# EAGLE schematic High-Level PCB v3.0 - SAVE 6 footprints (EAGLE 8.7.0)
TITLE: High-Level PCB
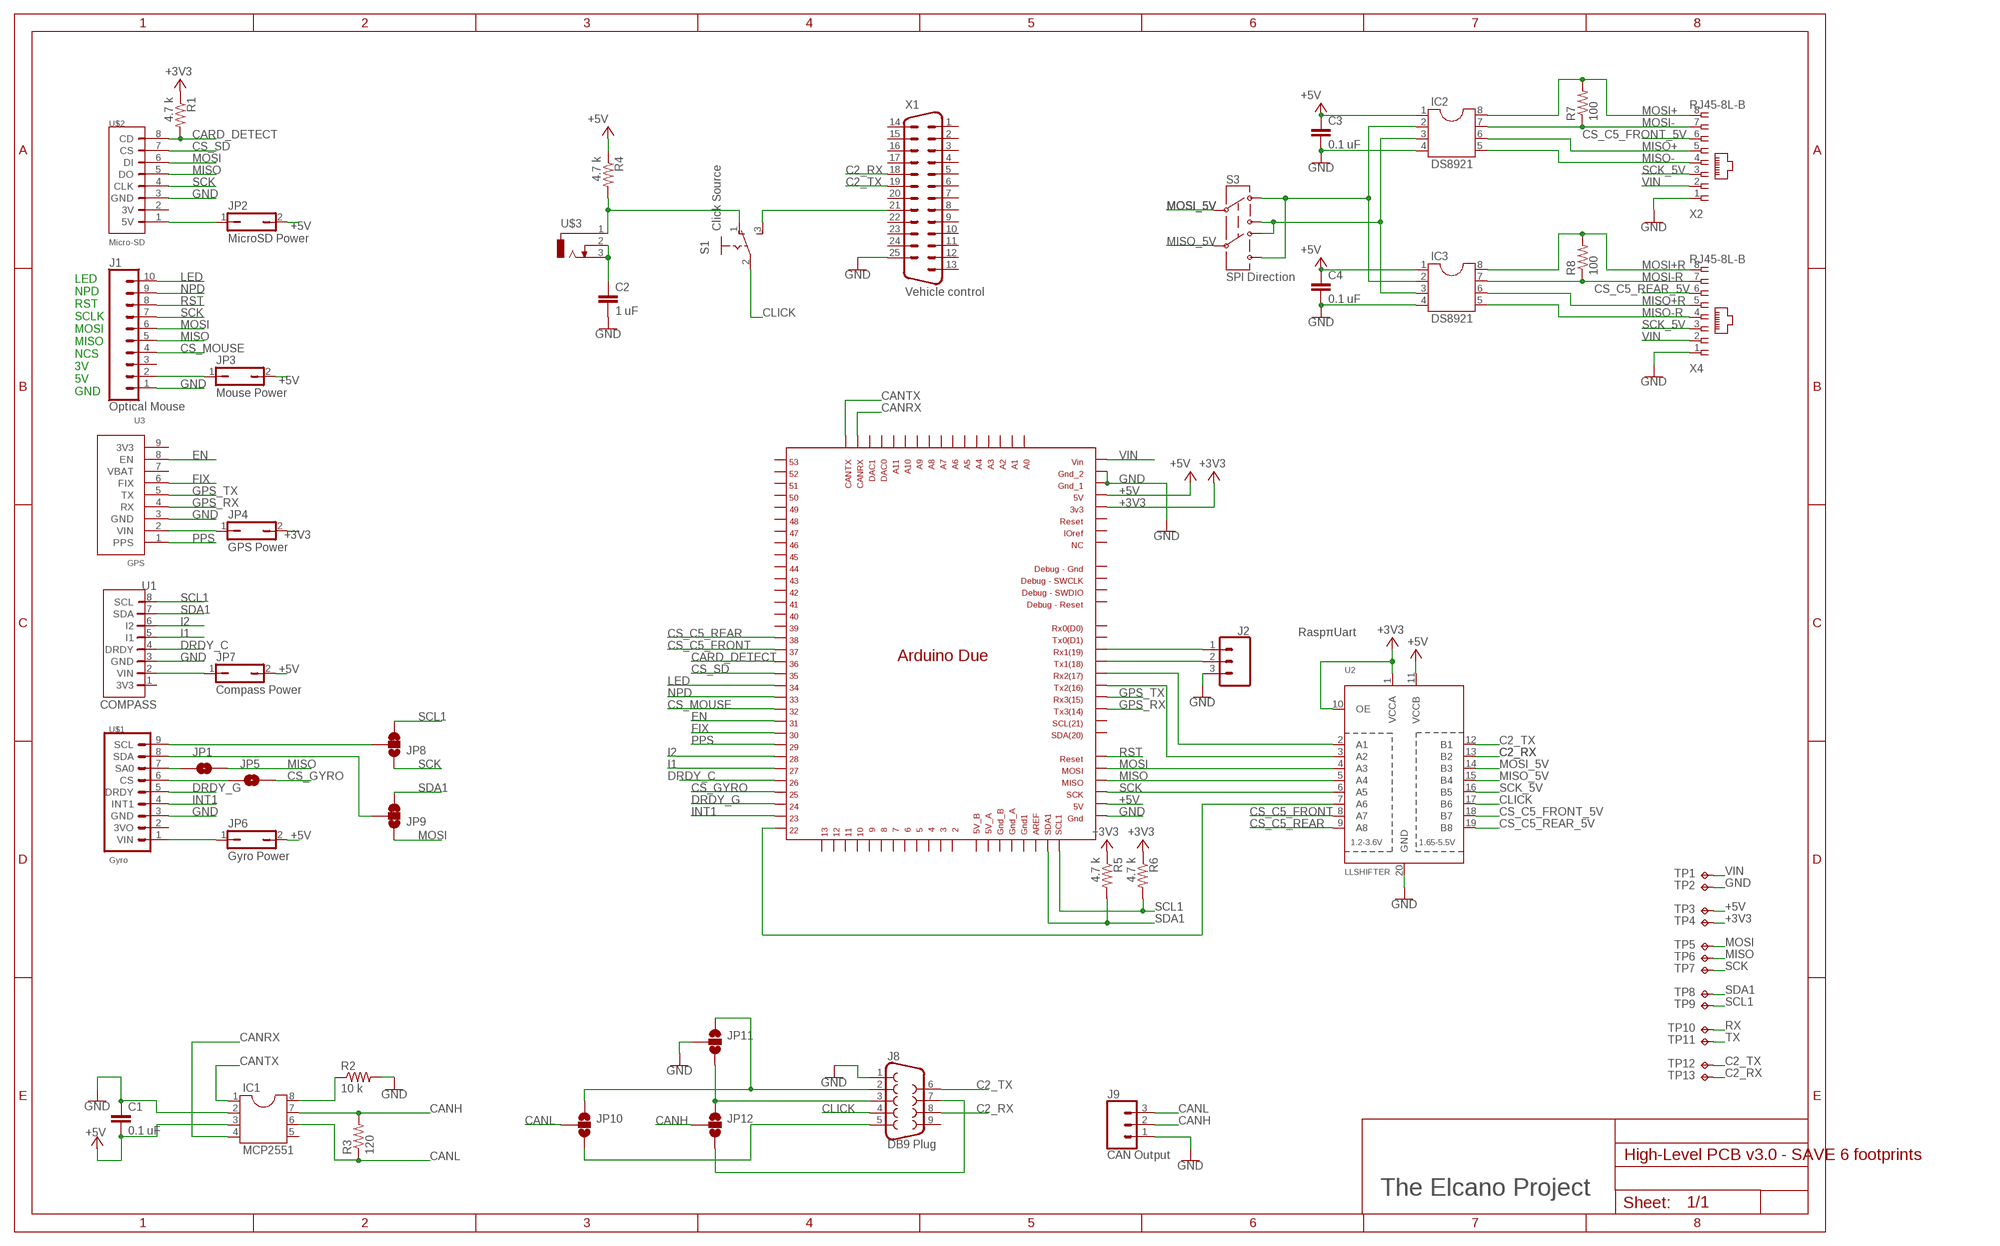
[diagram p0: schematic, sheet 1]

## Parts
C1  0.1 uF  C2.5/5  [C2.5-5]
C2  1 uF  C2.5/5  [C2.5-5]
C3  0.1 uF  C2.5/5  [C2.5-5]
C4  0.1 uF  C2.5/5  [C2.5-5]
IC1  MCP2551  DIL8  [DIL08]
IC2  DS8921  DIL8  [DIL08]
IC3  DS8921  DIL8  [DIL08]
J1  Optical Mouse  CONN_10"  [1X10]
J2  RaspπUart  CONN_02  [1X03]
J8  DB9 Plug  DB9MALE  [DB9_MALE]
J9  CAN Output  CONN_03-SCREW-5MM  [SCREWTERMINAL-5MM-3]
JP1  JUMPER-SMT_2_NO_SILK  [SMT-JUMPER_2_NO_SILK]
JP2  MicroSD Power  JP1Q  [JP1]
JP3  Mouse Power  JP1Q  [JP1]
JP4  GPS Power  JP1Q  [JP1]
JP5  JUMPER-SMT_2_NO_SILK  [SMT-JUMPER_2_NO_SILK]
JP6  Gyro Power  JP1Q  [JP1]
JP7  Compass Power  JP1Q  [JP1]
JP8  JUMPER-SMT_3_1-NC_TRACE_SILK  [SMT-JUMPER_3_1-NC_TRACE_SILK]
JP9  JUMPER-SMT_3_1-NC_TRACE_SILK  [SMT-JUMPER_3_1-NC_TRACE_SILK]
JP10  JUMPER-SMT_3_NO_SILK  [SMT-JUMPER_3_NO_SILK]
JP11  JUMPER-SMT_3_NO_SILK  [SMT-JUMPER_3_NO_SILK]
JP12  JUMPER-SMT_3_NO_SILK  [SMT-JUMPER_3_NO_SILK]
MCU2  DUE(NORMAL)  [DUE(NORMAL)]
R1  4.7 k  R-US_0204/7  [0204/7]
R2  10 k  R-US_0204/7  [0204/7]
R3  120  R-US_0204/7  [0204/7]
R4  4.7 k  R-US_0204/7  [0204/7]
R5  4.7 k  R-US_0204/7  [0204/7]
R6  4.7 k  R-US_0204/7  [0204/7]
R7  100  R-US_0204/7  [0204/7]
R8  100  R-US_0204/7  [0204/7]
S1  Click Source  255SB  [255SB]
S3  SPI Direction  DPDT  [DPDT]
TP1  TPPAD1-17  [P1-17]
TP2  TPPAD1-17  [P1-17]
TP3  TPPAD1-17  [P1-17]
TP4  TPPAD1-17  [P1-17]
TP5  TPPAD1-17  [P1-17]
TP6  TPPAD1-17  [P1-17]
TP7  TPPAD1-17  [P1-17]
TP8  TPPAD1-17  [P1-17]
TP9  TPPAD1-17  [P1-17]
TP10  TPPAD1-17  [P1-17]
TP11  TPPAD1-17  [P1-17]
TP12  TPPAD1-17  [P1-17]
TP13  TPPAD1-17  [P1-17]
U1  COMPASS  ELCOMPASS  [ELCOMPASS]
U2  LLSHIFTER  ELSHIFTER  [ELSHIFTER]
U3  GPS  ELGPS  [ELGPS]
U$1  Gyro  ELGYRO_L3GD20H  [ELGYRO]
U$2  Micro-SD  MINI_SD  [ELSDCARD]
U$3  2.5MMJACK  [2.5MMJACK]
X1  Vehicle control  M25H  [M25H]
X2  RJ45-8L-B  [RJ45-NO-SHIELD]
X4  RJ45-8L-B  [RJ45-NO-SHIELD]

## Nets
+3V3: JP4.2 MCU2.3V3 R1.1 R5.1 R6.1 TP4.TP U2.1(VCCA) U2.10(OE)
+5V: C1.2 C3.1 C4.1 IC1.3 IC2.1 IC3.1 JP2.2 JP3.2 JP6.2 JP7.2 MCU2.5V MCU2.GND_ICSP R4.1 TP3.TP U2.11(VCCB)
C2_RX: J8.8 TP13.TP U2.13(B2) X1.18
C2_TX: J8.6 TP12.TP U2.12(B1) X1.19
CANH: IC1.7 J9.2 JP12.2 R3.2
CANL: IC1.6 J9.3 JP10.2 R3.1
CANRX: IC1.4 MCU2.CANRX
CANTX: IC1.1 MCU2.CANTX
CARD_DETECT: MCU2.36 R1.2 U$2.8(CD)
CLICK: J8.4 S1.2(P) U2.17(B6)
CS_C5_FRONT: MCU2.37 U2.8(A7)
CS_C5_FRONT_5V: U2.18(B7) X2.6
CS_C5_REAR: MCU2.38 U2.9(A8)
CS_C5_REAR_5V: U2.19(B8) X4.6
CS_GYRO: JP5.2 MCU2.25
CS_MOUSE: J1.4 MCU2.32
CS_SD: MCU2.35 U$2.7(CS)
DRDY_C: MCU2.26 U1.4(DRDY)
DRDY_G: MCU2.24 U$1.5(DRDY)
EN: MCU2.31 U3.8(EN)
FIX: MCU2.30 U3.6(FIX)
GND: C1.1 C2.2 C3.2 C4.2 IC1.2 IC2.4 IC3.4 J1.1 J2.3 J8.1 J9.1 JP11.2 MCU2.5V_ICSP MCU2.GND_1 MCU2.GND_2 R2.2 TP2.TP U1.3(GND) U2.20(GND) U3.3(GND) U$1.3(GND) U$2.3(GND) X1.25 X2.1 X4.1
GPS_RX: MCU2.TX3 U3.4(RX)
GPS_TX: MCU2.RX3 U3.5(TX)
I1: MCU2.27 U1.5(I1)
I2: MCU2.28 U1.6(I2)
INT1: MCU2.23 U$1.4(INT1)
LED: J1.10 MCU2.34
MISO: J1.5 JP1.2 MCU2.MISO_ICSP TP6.TP U2.5(A4) U$2.5(DO)
MISO+: IC2.6 X2.5
MISO+R: IC3.6 X4.5
MISO-: IC2.5 X2.4
MISO-R: IC3.5 X4.4
MISO_5V: S3.5 U2.15(B4)
MOSI: J1.6 JP9.1 MCU2.MOSI_ICSP TP5.TP U2.4(A3) U$2.6(DI)
MOSI+: IC2.8 R7.2 X2.8
MOSI+R: IC3.8 R8.2 X4.8
MOSI-: IC2.7 R7.1 X2.7
MOSI-R: IC3.7 R8.1 X4.7
MOSI_5V: S3.2 U2.14(B3)
N$1: C2.1 U$3.2 U$3.3
N$2: IC2.2 IC3.2 S3.1 S3.6
N$3: IC2.3 IC3.3 S3.3 S3.4
N$4: MCU2.TX2 U2.3(A2)
N$5: MCU2.RX2 U2.2(A1)
N$6: S1.3(S) X1.21
N$7: R4.2 S1.1(O) U$3.1
N$8: JP7.1 U1.2(VIN)
N$9: JP6.1 U$1.1(VIN)
N$10: JP2.1 U$2.1(5V)
N$11: J8.3 JP11.3 JP12.1
N$12: MCU2.22 U2.7(A6)
N$13: J1.2 JP3.1
N$14: JP4.1 U3.2(VIN)
N$15: J8.5 JP10.3
N$16: J8.7 JP12.3
N$17: IC1.8 R2.1
N$18: J8.2 JP10.1 JP11.1
N$19: JP5.1 U$1.6(CS)
N$20: JP1.1 U$1.7(SA0)
N$21: JP9.2 U$1.8(SDA)
N$22: JP8.2 U$1.9(SCL)
N$23: J2.1 MCU2.RX1
N$24: J2.2 MCU2.TX1
NPD: J1.9 MCU2.33
PPS: MCU2.29 U3.1(PPS)
RST: J1.8 MCU2.RESET_ICSP
RX: TP10.TP
SCK: J1.7 JP8.1 MCU2.SCK_ICSP TP7.TP U2.6(A5) U$2.4(CLK)
SCK_5V: U2.16(B5) X2.3 X4.3
SCL1: JP8.3 MCU2.SCL1 R6.2 TP9.TP U1.8(SCL)
SDA1: JP9.3 MCU2.SDA1 R5.2 TP8.TP U1.7(SDA)
TX: TP11.TP
VIN: MCU2.VIN TP1.TP X2.2 X4.2
Unconnected: IC1.5 J1.3 J8.9 MCU2.2 MCU2.3 MCU2.4 MCU2.5 MCU2.5V_A MCU2.5V_B MCU2.6 MCU2.7 MCU2.8 MCU2.9 MCU2.10 MCU2.11 MCU2.12 MCU2.13 MCU2.39 MCU2.40 MCU2.41 MCU2.42 MCU2.43 MCU2.44 MCU2.45 MCU2.46 MCU2.47 MCU2.48 MCU2.49 MCU2.50 MCU2.51 MCU2.52 MCU2.53 MCU2.A0 MCU2.A1 MCU2.A2 MCU2.A3 MCU2.A4 MCU2.A5 MCU2.A6 MCU2.A7 MCU2.A8 MCU2.A9 MCU2.A10 MCU2.A11 MCU2.AREF MCU2.DAC0 MCU2.DAC1 MCU2.GND1 MCU2.GND_A MCU2.GND_B MCU2.GND_DEBUG MCU2.IOREF MCU2.NC MCU2.RESET MCU2.RESET_DEBUG MCU2.RX0 MCU2.SCL MCU2.SDA MCU2.SWCLK_DEBUG MCU2.SWDIO_DEBUG MCU2.TX0 U1.1(3V3) U3.7(VBAT) U3.9(3V3) U$1.2(3VO) U$2.2(3V) X1.1 X1.2 X1.3 X1.4 X1.5 X1.6 X1.7 X1.8 X1.9 X1.10 X1.11 X1.12 X1.13 X1.14 X1.15 X1.16 X1.17 X1.20 X1.22 X1.23 X1.24

## Notes on the sheet
- LED
  NPD
  RST
  SCLK
  MOSI
  MISO
  NCS
  3V
  5V
  GND
- The Elcano Project

## Library data of the parts
C1-C4 = capacitor-wima:C: CAPACITOR naming: grid - package width
IC1-IC3 = ic-package:DIL8: Dual In Line / Socket
J1 = SparkFun-Connectors:CONN_10: Multi connection point. Often used as Generic Header-pin footprint for 0.1 inch spaced/style header connections On any of the 0.1 inch spaced packages, you can populate with these: Break Away Headers - Straight <https://www.sparkfun.com/products/116> (PRT-00116) Break Away Male Headers - Right Angle <https://www.sparkfun.com/products/553> (PRT-00553) Female Headers <https://www.sparkfun.com/products/115> (PRT-00115) Break Away Headers - Machine Pin <https://www.sparkfun.com/products/117> (PRT-00117) Break Away Female Headers - Swiss Machine Pin <https://www.sparkfun.com/products/743> (PRT-00743) Arduino Stackable Header - 10 Pin <https://www.sparkfun.com/products/11376> (PRT-11376) For SCREWTERMINALS and SPRING TERMINALS visit here: Screw Terimnals on SparkFun.com <https://www.sparkfun.com/search/results?term=Screw+Terminals> (5mm/3.5mm/2.54mm spacing) This device is also useful as a general connection point to wire up your design to another part of your project. Our various solder wires solder well into these plated through hole pads. Hook-Up Wire - Assortment (Stranded, 22 AWG) <https://www.sparkfun.com/products/11375> (PRT-11375) Hook-Up Wire - Assortment (Solid Core, 22 AWG) <https://www.sparkfun.com/products/11367> (PRT-11367) View the entire wire category on our website here <https://www.sparkfun.com/categories/141> Special notes: Molex polarized connector foot print use with SKU : PRT-08231 with associated crimp pins and housings. 1MM SMD Version SKU: PRT-10208 NOTES ON THE VARIANTS LOCK and LOCK_LONGPADS... This footprint was designed to help hold the alignment of a through-hole component (i.e. 6-pin header) while soldering it into place. You may notice that each hole has been shifted either up or down by 0.005 of an inch from it's more standard position (which is a perfectly straight line). This slight alteration caused the pins (the squares in the middle) to touch the edges of the holes. Because they are alternating, it causes a "brace" to hold the component in place. 0.005 has proven to be the perfect amount of "off-center" position when using our standard breakaway headers. Although looks a little odd when you look at the bare footprint, once you have a header in there, the alteration is very hard to notice. Also,if you push a header all the way into place, it is covered up entirely on the bottom side.; PROD_ID: CONN-11563
J2 = tx_rxRasp:CONN_02: Multi connection point. Often used as Generic Header-pin footprint for 0.1 inch spaced/style header connections On any of the 0.1 inch spaced packages, you can populate with these: Break Away Headers - Straight <https://www.sparkfun.com/products/116> (PRT-00116) Break Away Male Headers - Right Angle <https://www.sparkfun.com/products/553> (PRT-00553) Female Headers <https://www.sparkfun.com/products/115> (PRT-00115) Break Away Headers - Machine Pin <https://www.sparkfun.com/products/117> (PRT-00117) Break Away Female Headers - Swiss Machine Pin <https://www.sparkfun.com/products/743> (PRT-00743) For SCREWTERMINALS and SPRING TERMINALS visit here: Screw Terimnals on SparkFun.com <https://www.sparkfun.com/search/results?term=Screw+Terminals> (5mm/3.5mm/2.54mm spacing) This device is also useful as a general connection point to wire up your design to another part of your project. Our various solder wires solder well into these plated through hole pads. Hook-Up Wire - Assortment (Stranded, 22 AWG) <https://www.sparkfun.com/products/11375> (PRT-11375) Hook-Up Wire - Assortment (Solid Core, 22 AWG) <https://www.sparkfun.com/products/11367> (PRT-11367) View the entire wire category on our website here <https://www.sparkfun.com/categories/141> Special notes: Molex polarized connector foot print use with: PRT-08233 with associated crimp pins and housings. 2.54_SCREWTERM for use with PRT-10571. 3.5mm Screw Terminal footprints for PRT-08084 5mm Screw Terminal footprints for use with PRT-08432
J8 = SparkFun-Connectors:DB9: DB9 Connector Standard DB9 (D-Sub 9) serial connector. Can be used for CAN bus as well as RS485 and RS232. Footprint production proven. Here is the female version connector we sell at SparkFun: 9 Pin Female Serial Connector - PCB Mount <https://www.sparkfun.com/products/429> (PRT-00429) This connector has been used on the following SparkFun products: SparkFun RS232 Shifter - SMD <https://www.sparkfun.com/products/449> (PRT-00449) SparkFun RS232 Shifter SMD (No DB9) <https://www.sparkfun.com/products/8780> (PRT-08780); PROD_ID: CONN-09904; SPICEPREFIX: X
J9 = SparkFun-Connectors:CONN_03: Multi connection point. Often used as Generic Header-pin footprint for 0.1 inch spaced/style header connections On any of the 0.1 inch spaced packages, you can populate with these: Break Away Headers - Straight <https://www.sparkfun.com/products/116> (PRT-00116) Break Away Male Headers - Right Angle <https://www.sparkfun.com/products/553> (PRT-00553) Female Headers <https://www.sparkfun.com/products/115> (PRT-00115) Break Away Headers - Machine Pin <https://www.sparkfun.com/products/117> (PRT-00117) Break Away Female Headers - Swiss Machine Pin <https://www.sparkfun.com/products/743> (PRT-00743) Stackable Header - 3 Pin (Female, 0.1") <https://www.sparkfun.com/products/13875> (PRT-13875) For SCREWTERMINALS and SPRING TERMINALS visit here: Screw Terimnals on SparkFun.com <https://www.sparkfun.com/search/results?term=Screw+Terminals> (5mm/3.5mm/2.54mm spacing) This device is also useful as a general connection point to wire up your design to another part of your project. Our various solder wires solder well into these plated through hole pads. Hook-Up Wire - Assortment (Stranded, 22 AWG) <https://www.sparkfun.com/products/11375> (PRT-11375) Hook-Up Wire - Assortment (Solid Core, 22 AWG) <https://www.sparkfun.com/products/11367> (PRT-11367) View the entire wire category on our website here <https://www.sparkfun.com/categories/141> Special notes: Molex polarized connector foot print use with SKU : PRT-08232 with associated crimp pins and housings.; PROD_ID: CONN-10134; SF_SKU: PRT-08433
JP1 JP5 = SparkFun-Jumpers:JUMPER-SMT_2_NO: Normally open jumper This jumper has two pads in close proximity to each other. Apply solder to close the connection. Round pads are easier to solder for beginners, but are a lot larger. SparkFun Product that uses the round pads: SparkFun EL Sequencer <https://www.sparkfun.com/products/12781>
JP2-JP4 JP6 JP7 = jumper:JP1Q: JUMPER
JP8 JP9 = SparkFun-Jumpers:JUMPER-SMT_3_1-NC_TRACE: Normally closed trace jumper (1 of 2 connections) This jumper has a trace between two pads so it's normally closed (NC). The other connection is normally open (NO). Use a razor knife to open the connection. For best results follow the IPC guidelines for cutting traces: Cutout at least 0.063 mm (0.005 in). Remove all loose material to clean up the cut area. Seal the cut with an approved epoxy. Reapply solder to reclose the connection, or to close the NO connection.
JP10-JP12 = SparkFun-Jumpers:JUMPER-SMT_3_NO: Normally open jumper This jumper has three pads in close proximity to each other. Apply solder to close the connection(s).
MCU2 = DUElib130425:DUE(NORMAL)
R1 R4-R6 = resistor:R-US_: RESISTOR, American symbol
R2 R3 R7 R8 = rcl:R-US_: RESISTOR, American symbol; SPICEPREFIX: R
S1 = switch:255SB: SLIDING SWITCH Distributor Buerklin, 11G810
S3 = ELCano_Footprints:DPDT
TP1-TP13 = testpad:TP: Test pad
U1 = ELCOMPASS:ELCOMPASS: ADAFRUIT LSM303DLHC COMPASS FOOT PRINT
U2 = ELSHIFTER:ELSHIFTER: TXB0108 LEVEL SHIFTER. Foot Print for adafruit breakout board.
U3 = ELGPS:ELGPS: FootPrint for Adafruit Ultimate GPS.
U$1 = ELCano_Footprints:ELGYRO_L3GD20H
U$2 = ELCano_Footprints:MINI_SD: SD Breakoutboard footprint for ELCano Project https://learn.adafruit.com/adafruit-micro-sd-breakout-board-card-tutorial/introduction
U$3 = ELCano_Footprints:2.5MMJACK: New jack for Elcano
X1 = con-subd:M25: SUB-D; OC_FARNELL: unknown; OC_NEWARK: unknown
X2 X4 = con-tycoelectronics:RJ45: CORCOM Modular RJ Jacks No Shield Source: www.tycoelectronics.com .. ENG_DS_1654001_1099_RJ_L_0507.pdf; MF: TYCO ELECTRONICS; MPN: RJ45-8L-B; OC_FARNELL: 1279843; OC_NEWARK: 52K4445

## Net classes
1 Power: width 0.508 mm, drill 0.305 mm, clearance 0.254 mm